# Altium schematic sheet Connector.SchDoc
size A; SheetNumber: 1; SheetTotal: 1
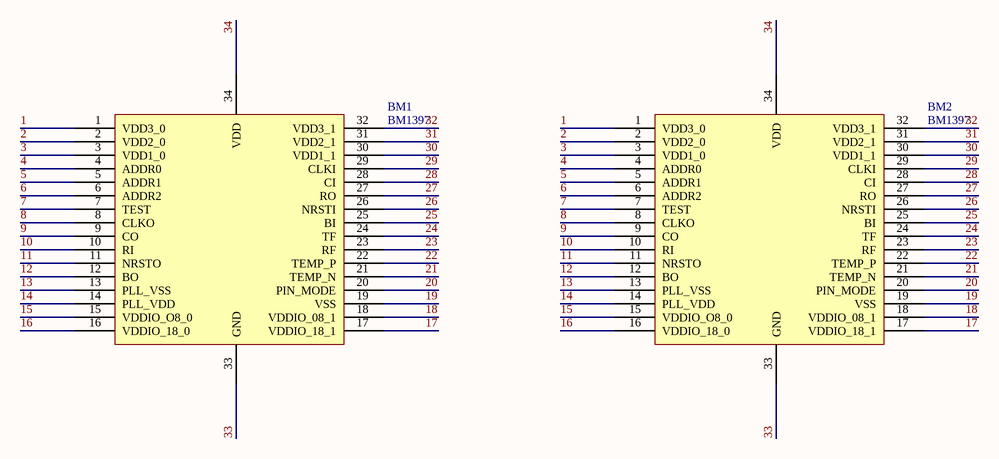
[diagram p0: Connector.SchDoc]

## Parts
BM1  BM1397  [BM1387]
BM2  BM1397  [Connector]

## Nets
1: BM1.1(VDD3_0) BM2.1(VDD3_0)
2: BM1.2(VDD2_0) BM2.2(VDD2_0)
3: BM1.3(VDD1_0) BM2.3(VDD1_0)
4: BM1.4(ADDR0) BM2.4(ADDR0)
5: BM1.5(ADDR1) BM2.5(ADDR1)
6: BM1.6(ADDR2) BM2.6(ADDR2)
7: BM1.7(TEST) BM2.7(TEST)
8: BM1.8(CLKO) BM2.8(CLKO)
9: BM1.9(CO) BM2.9(CO)
10: BM1.10(RI) BM2.10(RI)
11: BM1.11(NRSTO) BM2.11(NRSTO)
12: BM1.12(BO) BM2.12(BO)
13: BM1.13(PLL_VSS) BM2.13(PLL_VSS)
14: BM1.14(PLL_VDD) BM2.14(PLL_VDD)
15: BM1.15(VDDIO_O8_0) BM2.15(VDDIO_O8_0)
16: BM1.16(VDDIO_18_0) BM2.16(VDDIO_18_0)
17: BM1.17(VDDIO_18_1) BM2.17(VDDIO_18_1)
18: BM1.18(VDDIO_08_1) BM2.18(VDDIO_08_1)
19: BM1.19(VSS) BM2.19(VSS)
20: BM1.20(PIN_MODE) BM2.20(PIN_MODE)
21: BM1.21(TEMP_N) BM2.21(TEMP_N)
22: BM1.22(TEMP_P) BM2.22(TEMP_P)
23: BM1.23(RF) BM2.23(RF)
24: BM1.24(TF) BM2.24(TF)
25: BM1.25(BI) BM2.25(BI)
26: BM1.26(NRSTI) BM2.26(NRSTI)
27: BM1.27(RO) BM2.27(RO)
28: BM1.28(CI) BM2.28(CI)
29: BM1.29(CLKI) BM2.29(CLKI)
30: BM1.30(VDD1_1) BM2.30(VDD1_1)
31: BM1.31(VDD2_1) BM2.31(VDD2_1)
32: BM1.32(VDD3_1) BM2.32(VDD3_1)
33: BM1.33(GND) BM2.33(GND)
34: BM1.34(VDD) BM2.34(VDD)

## Library data of the parts
BM1 BM2 = BM1397_0